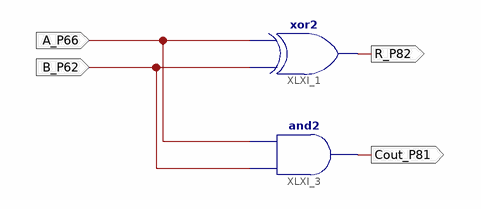
[diagram p0: schematic sheet 1]
// Xilinx ISE schematic HalfAdder.sch (spartan6) as structural Verilog: 2 symbols, 4 ports
module HalfAdder (
  input  A_P66,
  input  B_P62,
  output R_P82,
  output Cout_P81
);

  xor XLXI_1 (R_P82, B_P62, A_P66);
  and XLXI_3 (Cout_P81, B_P62, A_P66);
endmodule
